# Altium schematic sheet Control.SchDoc
size A3
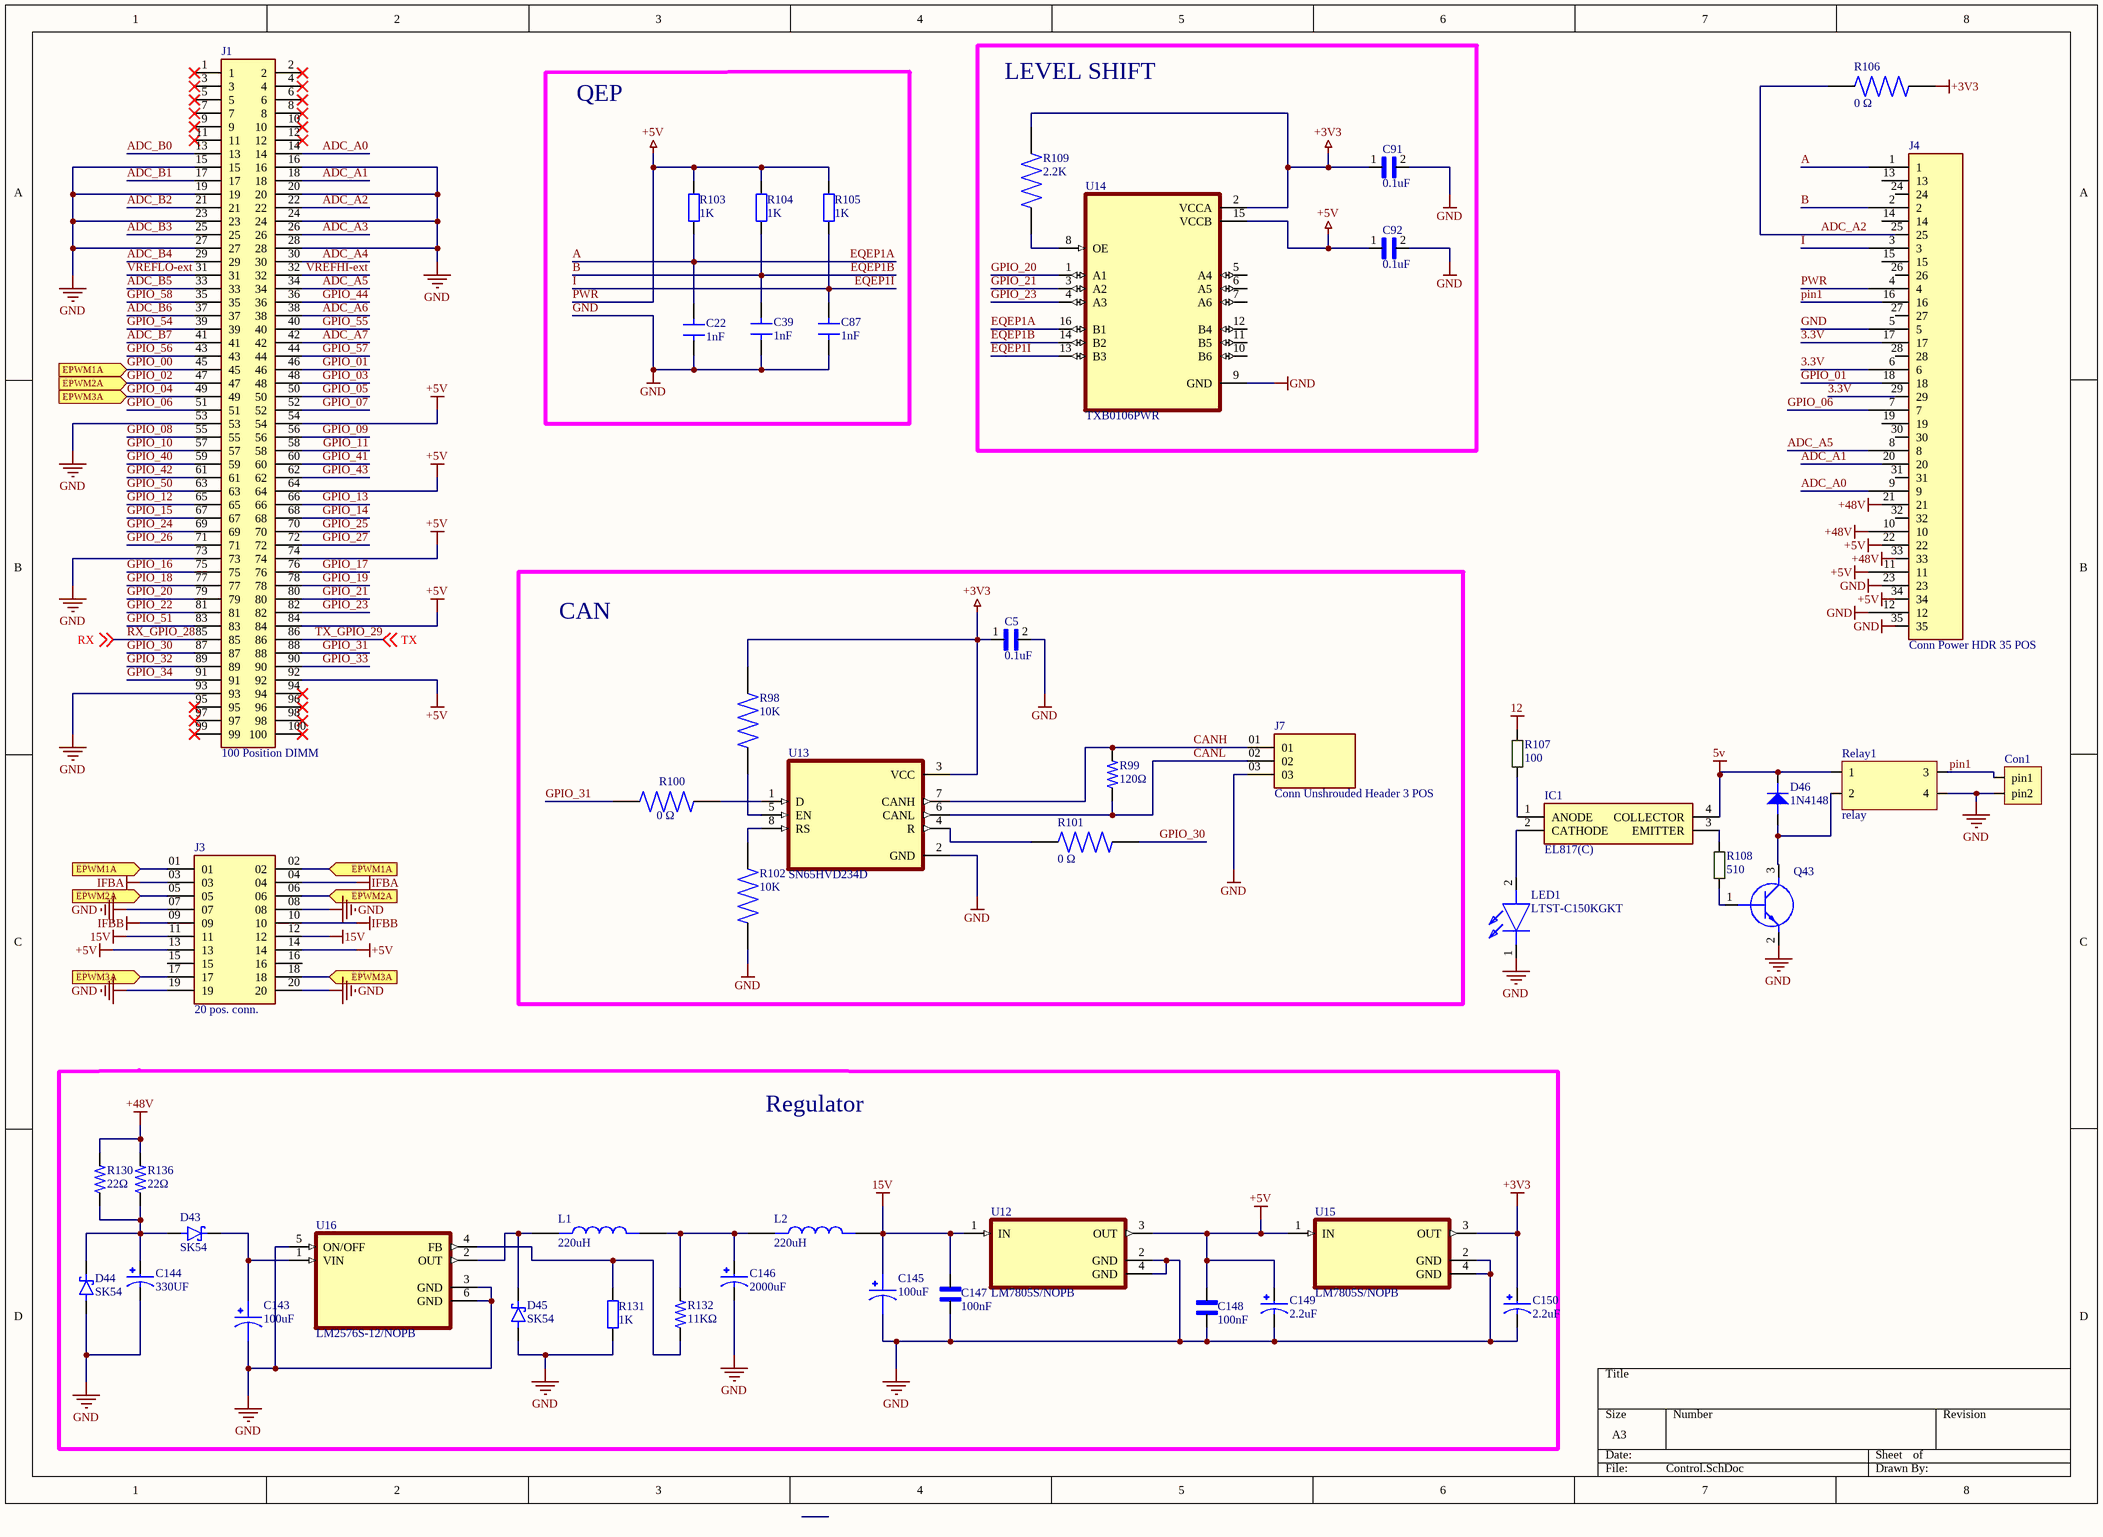
[diagram p0: Control.SchDoc]

## Parts
C5  0.1uF  [CAPC2012X88N]
C22  1nF  [CAP 1206_3216 - 1.8MM]
C39  1nF  [CAP 1206_3216 - 1.8MM]
C87  1nF  [CAP 1206_3216 - 1.8MM]
C91  0.1uF  [CAPC2012X88N]
C92  0.1uF  [CAPC2012X88N]
C143  100uF  [CapSmdElc]
C144  330UF  [CAP_EEETC1C331V]
C145  100uF  [CapSmdElc]
C146  2000uF  [CAPPRD500W60D1000H1600]
C147  100nF  [C-0805W]
C148  100nF  [C-0805W]
C149  2.2uF  [CapSmdElc]
C150  2.2uF  [CapSmdElc]
Con1  2pinConnector  [2pinCon]  (value not drawn)
D43  SK54  [DIOM7959X265N]
D44  SK54  [DIOM7959X265N]
D45  SK54  [DIOM7959X265N]
D46  1N4148  [SOD-123]
IC1  EL817(C)  [DIP762W60P254L458H480Q4N]
J1  100 Position DIMM  [TE_5390213-1]
J3  20 pos. conn.  [SAMTEC_SSQ-110-X-X-D]
J4  Conn Power HDR 35 POS  [TE_776230-2]
J7  Conn Unshrouded Header 3 POS  [SAMTEC_TSW-103-17-S-S]
L1  220uH  [IND_MDH12577C-101MA=P3]
L2  220uH  [IND_MDH12577C-101MA=P3]
LED1  LTST-C150KGKT  [L-1206]
Q43  BC817-40,235  [SOT95P230X110-3N]  (value not drawn)
R98  10K  [RESC2012X70N]
R99  120Ω  [RESC2012X65N]
R100  0 Ω  [RES 0.0 OHM 1206]
R101  0 Ω  [RES 0.0 OHM 1206]
R102  10K  [RESC2012X70N]
R103  Deger: 1K  [RES_0805]  (hidden comment: RES SMD 1K OHM 1% 1/8W 0805)
R104  Deger: 1K  [RES_0805]  (hidden comment: RES SMD 1K OHM 1% 1/8W 0805)
R105  Deger: 1K  [RES_0805]  (hidden comment: RES SMD 1K OHM 1% 1/8W 0805)
R106  0 Ω  [RES 0.0 OHM 1206]
R107  100  [R-1206]
R108  510  [R-1206]
R109  2.2K  [RESC3115X65N-2.2K-1206]
R130  22Ω  [R-2512R]
R131  Deger: 1K  [RES_0805]  (hidden comment: RES SMD 1K OHM 1% 1/8W 0805)
R132  11KΩ  [RESC2012X50N]
R136  22Ω  [R-2512R]
Relay1  relay  [Relay]
U12  LM7805S/NOPB  [TO254P1524X483-4N]
U13  SN65HVD234D  [SOIC127P599X175-8N]
U14  TXB0106PWR  [SOP65P640X120-16N]
U15  LM7805S/NOPB  [TO254P1524X483-4N]
U16  LM2576S-12/NOPB  [VREG_TPS79625KTTR]

## Blocks framed on the sheet
QEP: C22 C39 C87 R103-R105
LEVEL SHIFT: C91 C92 R109 U14
CAN: C5 J7 R98-R102 U13
Regulator: C143-C150 D43-D45 L1 L2 R130-R132 R136 U12 U15 U16

## Ports
EPWM1A (in), EPWM2A (in), EPWM3A (in)

## Nets
5v: D46.k IC1.4(COLLECTOR) Relay1.1
12: R107.2
15V: C145.1 C147.2 J3.11 J3.12 L2.2 U12.1(IN)
+3V3: C5.1 C91.1 C150.1 R98.2 R106.1 R109.2 U13.3(VCC) U14.2(VCCA) U15.3(OUT)
+48V: J4.10 J4.21 J4.33 R130.2 R136.2
GND: C5.2 C22.1 C39.1 C87.1 C91.2 C92.2 C143.2 C144.2 C145.2 C146.N C147.1 C148.1 C149.2 C150.2 Con1.2(pin2) D44.A D45.A J1.15 J1.16 J1.19 J1.20 J1.23 J1.24 J1.27 J1.28 J1.53 J1.73 J1.93 J3.07 J3.08 J3.19 J3.20 J4.5 J4.12 J4.23 J4.35 J7.03 LED1.1(K) Q43.2(E) R102.1 R131.1 Relay1.4 U12.2(GND) U12.4(GND) U13.2(GND) U14.9(GND) U15.2(GND) U15.4(GND) U16.3(GND) U16.5(ON/OFF) U16.6(GND)
IFBA: J3.03 J3.04
IFBB: J3.09 J3.10
PWR: C92.1 C148.2 C149.1 J1.54 J1.64 J1.74 J1.84 J1.92 J3.13 J3.14 J4.4 J4.11 J4.22 J4.34 R103.2 R104.2 R105.2 U12.3(OUT) U14.15(VCCB) U15.1(IN)  [also labelled +5V]
3.3V: J4.6 J4.17 J4.29
A: C22.2 J4.1 R103.1 U14.16(B1)  [also labelled EQEP1A]
ADC_A0: J1.14 J4.9
ADC_A1: J1.18 J4.20
ADC_A2: J1.22 J4.25 R106.2
ADC_A3: J1.26
ADC_A4: J1.30
ADC_A5: J1.34 J4.8
ADC_A6: J1.38
ADC_A7: J1.42
ADC_B0: J1.13
ADC_B1: J1.17
ADC_B2: J1.21
ADC_B3: J1.25
ADC_B4: J1.29
ADC_B5: J1.33
ADC_B6: J1.37
ADC_B7: J1.41
B: C39.2 J4.2 R104.1 U14.14(B2)  [also labelled EQEP1B]
CANH: J7.01 R99.2 U13.7(CANH)
CANL: J7.02 R99.1 U13.6(CANL)
EQEP1I: C87.2 J4.3 R105.1 U14.13(B3)  [also labelled I]
GPIO_00: J1.45 J3.01 J3.02 ; port EPWM1A
GPIO_01: J1.46 J4.18
GPIO_02: J1.47 J3.05 J3.06 ; port EPWM2A
GPIO_03: J1.48
GPIO_04: J1.49 J3.17 J3.18 ; port EPWM3A
GPIO_05: J1.50
GPIO_06: J1.51 J4.7
GPIO_07: J1.52
GPIO_08: J1.55
GPIO_09: J1.56
GPIO_10: J1.57
GPIO_11: J1.58
GPIO_12: J1.65
GPIO_13: J1.66
GPIO_14: J1.68
GPIO_15: J1.67
GPIO_16: J1.75
GPIO_17: J1.76
GPIO_18: J1.77
GPIO_19: J1.78
GPIO_20: J1.79 U14.1(A1)
GPIO_21: J1.80 U14.3(A2)
GPIO_22: J1.81
GPIO_23: J1.82 U14.4(A3)
GPIO_24: J1.69
GPIO_25: J1.70
GPIO_26: J1.71
GPIO_27: J1.72
GPIO_30: J1.87 R101.1
GPIO_31: J1.88 R100.1
GPIO_32: J1.89
GPIO_33: J1.90
GPIO_34: J1.91
GPIO_40: J1.59
GPIO_41: J1.60
GPIO_42: J1.61
GPIO_43: J1.62
GPIO_44: J1.36
GPIO_50: J1.63
GPIO_51: J1.83
GPIO_54: J1.39
GPIO_55: J1.40
GPIO_56: J1.43
GPIO_57: J1.44
GPIO_58: J1.35
pin1: Con1.1(pin1) J4.16 Relay1.3
RX_GPIO_28: J1.85 ; off-sheet RX  [also labelled RX]
TX_GPIO_29: J1.86 ; off-sheet TX  [also labelled TX]
VREFHI-ext: J1.32
VREFLO-ext: J1.31
NetC143_1: C143.1 D43.C(K) U16.1(VIN)
NetC144_1: C144.1 D43.A D44.C(K) R130.1 R136.1
NetC146_P: C146.P L1.2 L2.1 R132.2
NetD45_C: D45.C(K) L1.1 U16.2(OUT)
NetD46_a: D46.a Q43.3(C) Relay1.2
NetIC1_1: IC1.1(ANODE) R107.1
NetIC1_2: IC1.2(CATHODE) LED1.2(A)
NetIC1_3: IC1.3(EMITTER) R108.2
NetQ43_1: Q43.1(B) R108.1
NetR98_1: R98.1 U13.5(EN)
NetR100_2: R100.2 U13.1(D)
NetR101_2: R101.2 U13.4(R)
NetR102_2: R102.2 U13.8(RS)
NetR109_1: R109.1 U14.8(OE)
NetR131_2: R131.2 R132.1 U16.4(FB)

Not connected (* = marked no-connect by the designer): J1 1* 2* 3* 4* 5* 6* 7* 8* 9* 10* 11* 12* 94* 95* 96* 97* 98* 99* 100*; J3 15 16; J4 13 14 15 19 24 26 27 28 30 31 32; U14 5(A4) 6(A5) 7(A6) 10(B6) 11(B5) 12(B4)

## Library data of the parts
C5 C91 C92 = CAP 0.1uF SMD 0805: Cap Ceramic 0.1uF 35V X7R 10% SMD 0805 125Â°C Paper T/R; MP: C0805C104K6RACTU; MF: KEMET; SnapEDA_Link: https://www.snapeda.com/parts/C0805C104K6RACTU/KEMET/view-part/2037626/?ref=snap; Value: *; Availability: Unavailable; Package: 0805 KEMET; Price: None
C22 C39 C87 = CAP 1nF 1206
C143 C145 = 100 uF Electr Cap
C144 = CAP 330UF SMD: CAP ALUM 330UF 20% 16V SMD; MP: EEE-TC1C331V; MF: Panasonic Electronic Components; Value: *; Package: RADIAL-2 Panasonic; Availability: In Stock; SnapEDA_Link: https://www.snapeda.com/parts/EEE-TC1C331V/Panasonic/view-part/6178283/?ref=snap; Price: None; Purchase-URL: https://pricing.snapeda.com/search/part/EEE-TC1C331V/?ref=eda; Check_prices: https://www.snapeda.com/parts/EEE-TC1C331V/Panasonic/view-part/6178283/?ref=eda
C146 = 2000uF: CAP ALUM 2000UF 20% 6.3V RADIAL - Electrolytic; MP: EEUFS0J202; MF: Panasonic; SnapEDA_Link: https://www.snapeda.com/parts/EEUFS0J202/Panasonic/view-part/5797032/?ref=snap; Package: RADIAL-2 Panasonic; Check_prices: https://www.snapeda.com/parts/EEUFS0J202/Panasonic/view-part/5797032/?ref=eda; Price: None; Value: *; Availability: No availability data
C147 C148 = CAP 100nF 50V SMT 0805: WCAP-CSGP General Purpose MLCC; SMT 0805; X7R; 100nF 10%; 50V; -55C to +125C; Tech. PN X7R0805104K050DFCT10000; MF: Wurth Electronics Inc; MP: 885012207098; Availability: Warning; Mouser-Purchase-URL: https://snapeda.com/shop?store=Mouser&id=4217223; Price: None; DigiKey-Purchase-URL: https://snapeda.com/shop?store=DigiKey&id=4217223; Package: 0805 Wurth Electronics; Value: *; SnapEDA_Link: https://www.snapeda.com/parts/885012207098/Wurth%20Electronics%20Inc/view-part/4217223/?ref=snap; BuyPart: https://www.snapeda.com/parts/885012207098/Wurth%20Electronics%20Inc/view-part/4217223/?ref=eda
C149 C150 = CAP 2.2uF: Electrolytic Capacitor
Con1 = 2pinConnector: CON.T.B.2.54MM 2P 180C MALE IVORY CONNFLY; Özdisan Part Number: DS1070-2MVV6; Manufacturer: CONNFLY; Link: https://www.ozdisan.com/konnektor-baglanti-elemanlari/konnektor-cesitleri/pcb-tipi-konnektorler/DS1070-2MVV6; Price: 0,01274+KDV
D43-D45 = SK54: Diode Schottky 40V 5A Surface Mount DO-214AA (SMB); MP: MBRS320T3G; MF: ON Semiconductor; Package: DO-214 ON Semiconductor; Availability: Good; Arrow_Electronics-Purchase-URL: https://snapeda.com/shop?store=Arrow+Electronics&id=432205; SnapEDA_Link: https://www.snapeda.com/parts/MBRS320T3G/ON%20Semiconductor/view-part/432205/?ref=snap; DigiKey-Purchase-URL: https://snapeda.com/shop?store=DigiKey&id=432205; Mouser-Purchase-URL: https://snapeda.com/shop?store=Mouser&id=432205; Value: *; Price: None
D46 = 1N4148: DIODE FAST SWITCHING Single 150mA 75V SMT SOD323; Özdisan Part Number: 1N4148WS-HT; Manufacturer: HOTTECH; Link: https://www.ozdisan.com/guc-yari-iletkenleri/diyot-modul-diyot-dogrultucular/genel-amacli-diyotlar/1N4148WS-HT; Price: 0,01818+KDV
IC1 = EL817(C): IC-817 OPTOC.TRANS.OUTPUT DIP4; Özdisan Part Number: PC817B=PC817X2NSZW; Manufacturer: SHARP; Link: https://www.ozdisan.com/optolar-sensorler/optolar/transistor-cikisli-optokuplorler/PC817BPC817X2NSZW; Price: 0,12190+KDV
J1 = 100 Position DIMM: 100 Position DIMM DRAM Socket Through Hole; MP: 5390213-1; Centerline_Pitch: 1.27 mm[.05 in]; MF: TE Connectivity; Number_of_Positions: 100; SnapEDA_Link: https://www.snapeda.com/parts/5390213-1/TE%20Connectivity%20AMP%20Connectors/view-part/781316/?ref=snap; TE_purchase_URL: https://www.te.com/usa-en/product-5390213-1.html?te_bu=Cor&te_type=disp&te_campaign=seda_glo_cor-seda-global-disp-prtnr-fy19-seda-model-bom-cta_sma-317_1&elqCampaignId=32493; Availability: Unavailable; EU_RoHS_Compliance: Compliant; Price: None; Product_Type: Socket; Package: None; Value: *
J3 = 20 pos. conn.: SSQ - Samtec 2.54mm Square Tail Dual Row Socket Strip 8.5mm Profile - Fast Stock; MP: SSQ-110-23-G-D; MF: Samtec; Purchase-URL: https://pricing.snapeda.com/search/part/SSQ-110-23-G-D/?ref=eda; Value: *; SnapEDA_Link: https://www.snapeda.com/parts/SSQ-110-23-G-D/Samtec/view-part/3247245/?ref=snap; Package: None; Check_prices: https://www.snapeda.com/parts/SSQ-110-23-G-D/Samtec/view-part/3247245/?ref=eda; Price: None; Availability: Bad
J4 = Conn Power HDR 35 POS: Conn Power HDR 35 POS 4mm Solder ST Thru-Hole 35 Terminal 1 Port Automotive Loose; MP: 776230-2; MF: TE Connectivity; Package: None; EU_RoHS_Compliance: Compliant; DigiKey-Purchase-URL: https://snapeda.com/shop?store=DigiKey&id=1466385; Value: *; Availability: Unavailable; Price: None; SnapEDA_Link: https://www.snapeda.com/parts/776230-2/TE%20Connectivity%20AMP%20Connectors/view-part/1466385/?ref=snap
J7 = Conn Unshrouded Header 3 POS: MP: TSW-103-17-S-S; Package: None; Price: None; Value: *; Availability: Unavailable
L1 L2 = 220uH Inductor SMD: Inductor Power Shielded Wirewound 220uH 20% 100KHz Ferrite 1.1A 0.325Ohm DCR 5049 Automotive T/R; MP: MDH12577C-101MA=P3; Package: None; Price: None; Value: *; Availability: Unavailable
LED1 = LTST-C150KGKT: LED SMD 1206 GREEN WATER CLEAR 18~71 mcd; Manufacturer: LITEON; Özdisan Part Number: LTST-C150KGKT; Link: https://www.ozdisan.com/led-led-aydinlatma-cozumleri/led-komponentler/renkli-led-sinyal/LTST-C150KGKT; Price: 0,07332+KDV
Q43 = BC817-40,235: TRANSISTOR DIS.500mA 45V NPN SOT23 GEN. SMT; Manufacturer: NXP (PHILIPS); Özdisan Part Number: BC817-40,235; Link: https://www.ozdisan.com/guc-yari-iletkenleri/transistor/discrete-transistorler/BC817-40235; Price: 0,01964+KDV
R98 R102 = RES 10K 0805: Precision Thick Film Surface Mnt Resistor 0805 10kOhm +/-0.5% 0.1W +/-50ppm/degC; MP: ERJ6RBD1002V; MF: Panasonic; Price: None; SnapEDA_Link: https://www.snapeda.com/parts/ERJ6RBD1002V/Panasonic/view-part/946355/?ref=snap; Availability: Unavailable; Value: *; Package: 2012 Panasonic Electronic Components
R99 = RES 120Ω 0805: RESISTOR, THICK FILM, 120R, 5%, 0805; MP: CRGS0805J120R; Package: None; Price: None; Value: *; Availability: Unavailable
R100 R101 R106 = RES 0.0 Ω 1206
R103-R105 R131 = 1K 0805: 1 kOhms ±1% 0.125W, 1/8W Chip Resistor 0805 (2012 Metric) Moisture Resistant Thick Film; Cins: Direnc; Uretici Kodu: RC0805FR-071KL; Kılıf: 0805; -Sicaklik: -55; +Sicaklik: +155; Lehim Yöntemi: SMD; MSL: 1 (Unlimited)
R107 = R-1206: RES.(3216) 1206 100 Ohms 5% 1/4W 100PPM; Özdisan Part Number: RC3216J101CS; Manufacturer: SAMSUNG; Link: https://www.ozdisan.com/pasif-komponentler/direncler/smt-smd-direncler/RC3216J101CS; Price: 0.00910+KDV
R108 = R-1206: RES.(3216) 1206 510 Ohms 1% 1/4W-S 100PPM; Özdisan Part Number: 1206S4F5100T5E; Manufacturer: ROYALOHM; Link: https://www.ozdisan.com/pasif-komponentler/direncler/smt-smd-direncler/1206S4F5100T5E; Price: 0,00442+KDV
R109 = RES 2.2K 1206: RES SMD 2.2K OHM 1% 1/4W 1206; MP: CRG1206F2K2/10; Package: None; Price: None; Value: *; Availability: Unavailable
R130 R136 = RES 22Ω 2512
R132 = RES 11KΩ SMD: THICK FILM RESISTOR, 11KOHM, 125mW, 5%; MP: CRCW080511K0JNEA; Package: None; Price: None; Value: *; Availability: Unavailable
Relay1 = relay: RELAY 3A 5VDC 1a PANASONIC; Özdisan Part Number: ALJ105W; Manufacturer: PANASONIC COMP.; Link: https://www.ozdisan.com/elektromekanik-komponentler/role-role-soketleri/genel-tip-roleler/ALJ105W; Price: 0.48151+KDV
U12 U15 = LM7805S/NOPB: 1.5-A, 30-V, linear voltage regulator 3-DDPAK/TO-263 0 to 125; MF: Texas Instruments; MP: LM7805S/NOPB; Value: *; SnapEDA_Link: https://www.snapeda.com/parts/LM7805S/NOPB/Texas%20Instruments/view-part/546227/?ref=snap; Price: None; Package: TO-263-3 Texas Instruments; DigiKey-Purchase-URL: https://snapeda.com/shop?store=DigiKey&id=546227; Texas_Instruments-Purchase-URL: https://snapeda.com/shop?store=Texas+Instruments&id=546227; Availability: Warning
U13 = SN65HVD234D: 3.3 V CAN Transceiver with Sleep Mode 8-SOIC -40 to 125; MF: Texas Instruments; Value: *; Package: SOIC-8 Texas Instruments; SnapEDA_Link: https://www.snapeda.com/parts/SN65HVD234D/Texas%20Instruments/view-part/75912/?ref=snap; Price: None; Texas_Instruments-Purchase-URL: https://snapeda.com/shop?store=Texas+Instruments&id=75912; Mouser-Purchase-URL: https://snapeda.com/shop?store=Mouser&id=75912; Availability: Good; DigiKey-Purchase-URL: https://snapeda.com/shop?store=DigiKey&id=75912; MP: SN65HVD234D; Check_prices: https://www.snapeda.com/parts/SN65HVD234D/Texas%20Instruments/view-part/75912/?ref=eda
U14 = TXB0106PWR: 6-Bit Bidirectional Voltage-Level Translator with Auto Direction Sensing and +/-15-kV ESD Protect 16-TSSOP -40 to 85; MF: Texas Instruments; Texas_Instruments-Purchase-URL: https://snapeda.com/shop?store=Texas+Instruments&id=134340; SnapEDA_Link: https://www.snapeda.com/parts/TXB0106PWR/Texas%20Instruments/view-part/134340/?ref=snap; Value: *; MP: TXB0106PWR; Package: TSSOP-16 Texas Instruments; DigiKey-Purchase-URL: https://snapeda.com/shop?store=DigiKey&id=134340; Availability: Warning; Price: None; Mouser-Purchase-URL: https://snapeda.com/shop?store=Mouser&id=134340; BuyPart: https://www.snapeda.com/parts/TXB0106PWR/Texas%20Instruments/view-part/134340/?ref=eda
U16 = LM2576S-12/NOPB: SIMPLE SWITCHER&reg; 40V, 3A Low Component Count Step-Down Regulator 5-DDPAK/TO-263 -40 to 125; MF: Texas Instruments; Availability: Warning; SnapEDA_Link: https://www.snapeda.com/parts/LM2576S-12/NOPB/Texas%20Instruments/view-part/470772/?ref=snap; Mouser-Purchase-URL: https://snapeda.com/shop?store=Mouser&id=470772; Texas_Instruments-Purchase-URL: https://snapeda.com/shop?store=Texas+Instruments&id=470772; Value: *; Price: None; Package: TO-263-5 Texas Instruments; DigiKey-Purchase-URL: https://snapeda.com/shop?store=DigiKey&id=470772; MP: LM2576S-12/NOPB; BuyPart: https://www.snapeda.com/parts/LM2576S-12/NOPB/Texas%20Instruments/view-part/470772/?ref=eda